# EAGLE design monoblink_wifi (EAGLE 9.0.0)
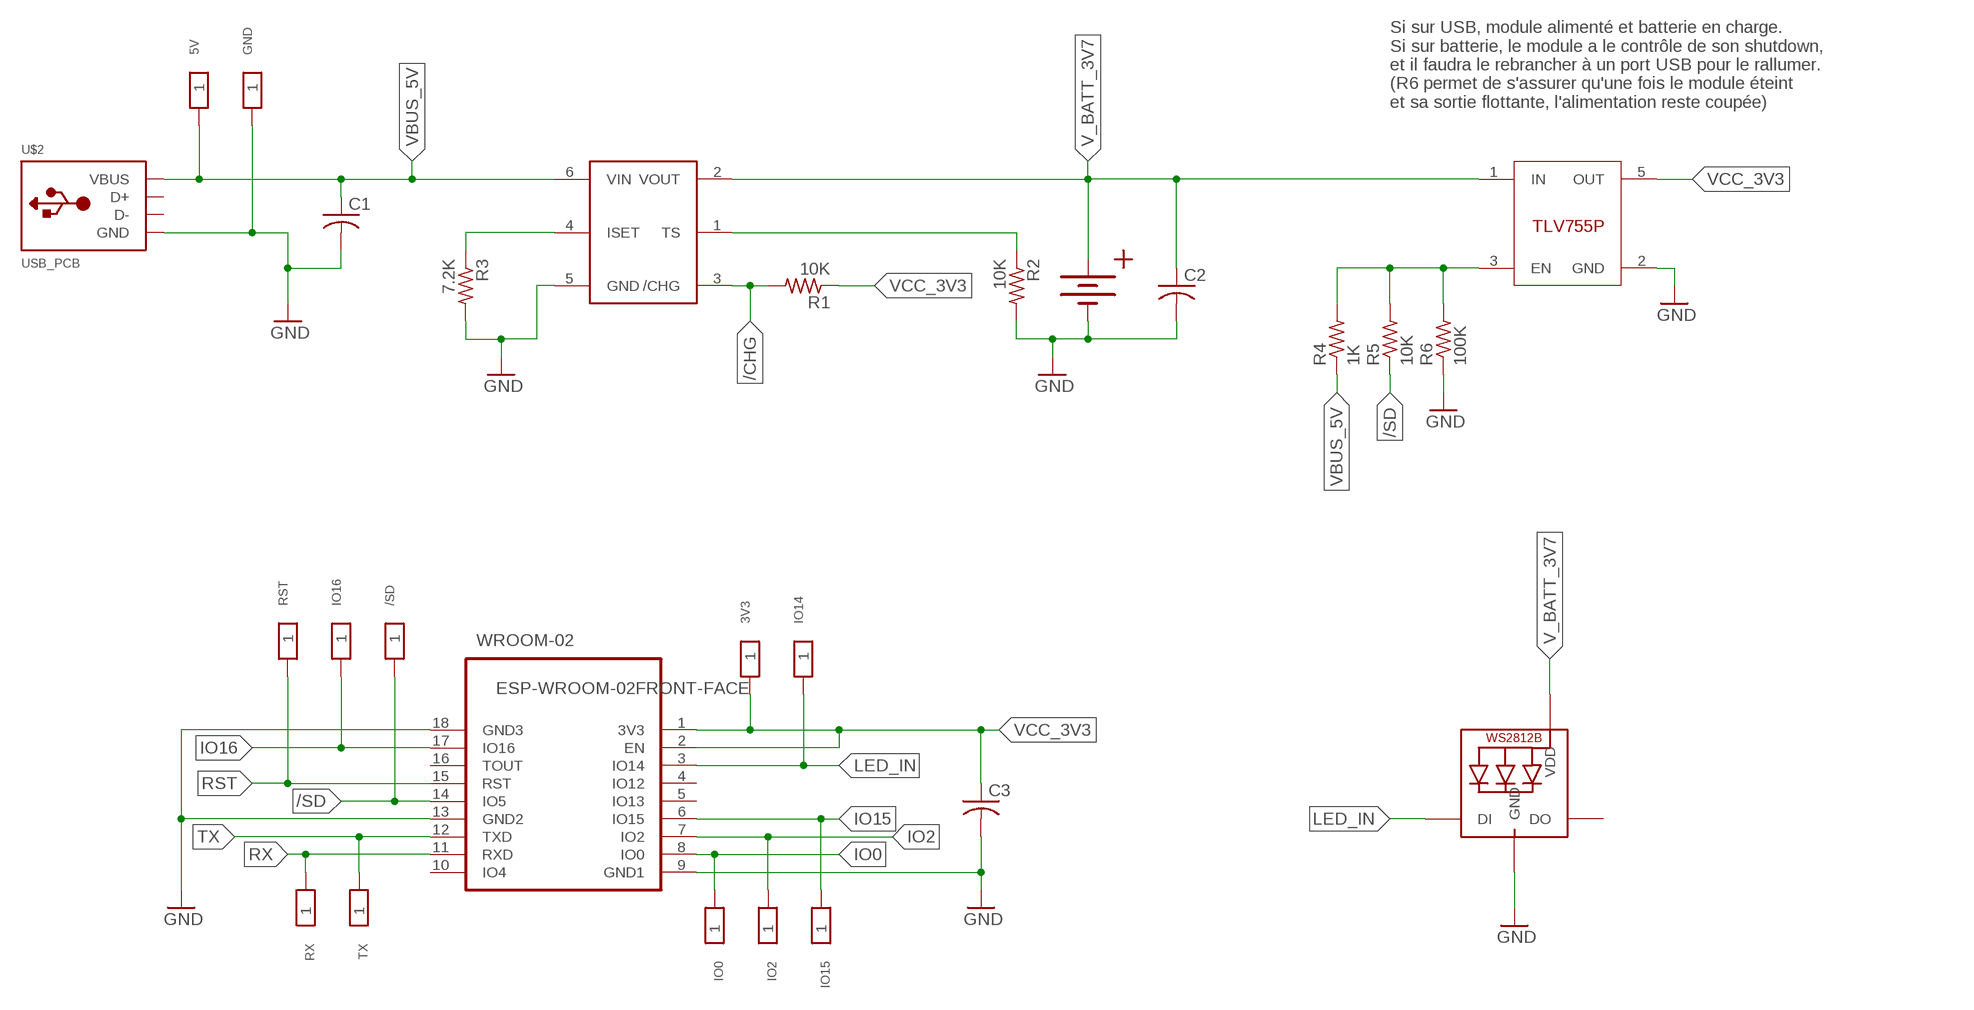
[diagram p0: schematic, sheet 1]

## Parts
3V3  TESTPAD_PROG  [TP1.5MM]
5V  TESTPAD_PROG  [TP1.5MM]
/SD  TESTPAD_PROG  [TP1.5MM]
C1  C-USC0603  [C0603]
C2  C-USC0603  [C0603]
C3  C-USC0603  [C0603]
CHG  BQ21040  [SOT23-6]
GND  TESTPAD_PROG  [TP1.5MM]
IO0  TESTPAD_PROG  [TP1.5MM]
IO2  TESTPAD_PROG  [TP1.5MM]
IO14  TESTPAD_PROG  [TP1.5MM]
IO15  TESTPAD_PROG  [TP1.5MM]
IO16  TESTPAD_PROG  [TP1.5MM]
LDO  TLV755P  [SOT23-5]
LED  WS2812B5050  [WS2812B]
R1  10K  R-US_R0603  [R0603]
R2  10K  R-US_R0603  [R0603]
R3  7.2K  R-US_R0603  [R0603]
R4  1K  R-US_R0603  [R0603]
R5  10K  R-US_R0603  [R0603]
R6  100K  R-US_R0603  [R0603]
RST  TESTPAD_PROG  [TP1.5MM]
RX  TESTPAD_PROG  [TP1.5MM]
TX  TESTPAD_PROG  [TP1.5MM]
U$2  USB_PCB  [USB_PADS]
U$5  BATT  [BATT_CON]
WROOM-02  ESP-WROOM-02FRONT-FACE  [FRONT-FACE]

## Nets
/CHG: CHG.3(/CHG) R1.2
/SD: /SD.1 R5.1 WROOM-02.14(IO5)
EN: LDO.3(EN) R4.2 R5.2 R6.2
GND: C1.2 C2.2 C3.2 CHG.5(GND) GND.1 LDO.2(GND) LED.3-GND(GND) R2.2 R3.2 R6.1 U$2.GND U$5.V-(-) WROOM-02.9(GND1) WROOM-02.13(GND2) WROOM-02.18(GND3)
IO0: IO0.1 WROOM-02.8(IO0)
IO2: IO2.1 WROOM-02.7(IO2)
IO15: IO15.1 WROOM-02.6(IO15)
IO16: IO16.1 WROOM-02.17(IO16)
ISET: CHG.4(ISET) R3.1
LED_IN: IO14.1 LED.4-DIN(DI) WROOM-02.3(IO14)
RST: RST.1 WROOM-02.15(RST)
RX: RX.1 WROOM-02.11(RXD)
TS: CHG.1(TS) R2.1
TX: TX.1 WROOM-02.12(TXD)
V_BATT_3V7: C2.1 CHG.2(VOUT) LDO.1(IN) LED.1-VDD(VDD) U$5.V+(+)
VBUS_5V: 5V.1 C1.1 CHG.6(VIN) R4.1 U$2.V_SUPPLY(VBUS)
VCC_3V3: 3V3.1 C3.1 LDO.5(OUT) R1.1 WROOM-02.1(3V3) WROOM-02.2(EN)
Unconnected: LED.2-DOUT(DO) U$2.D+ U$2.D- WROOM-02.4(IO12) WROOM-02.5(IO13) WROOM-02.10(IO4) WROOM-02.16(TOUT)

## Notes on the sheet
- Si sur USB, module alimenté et batterie en charge.
  Si sur batterie, le module a le contrôle de son shutdown,
  et il faudra le rebrancher à un port USB pour le rallumer.
  (R6 permet de s'assurer qu'une fois le module éteint
  et sa sortie flottante, l'alimentation reste coupée)

## Library data of the parts
3V3 5V /SD GND IO0 IO2 IO14-IO16 RST RX TX = monoblink_wifi:TESTPAD_PROG: TESTPAD
C1-C3 = monoblink_wifi:C-US: CAPACITOR, American symbol; SPICEPREFIX: C
CHG = monoblink_wifi:BQ21040
LDO = monoblink_wifi:TLV755P
LED = monoblink_wifi:WS2812B
R1-R6 = monoblink_wifi:R-US_: RESISTOR, American symbol; SPICEPREFIX: R
U$2 = monoblink_wifi:USB_PCB
U$5 = monoblink_wifi:BATT
WROOM-02 = monoblink_wifi:ESP-WROOM-02: WiFi module - ESP-WROOM-02

## Board
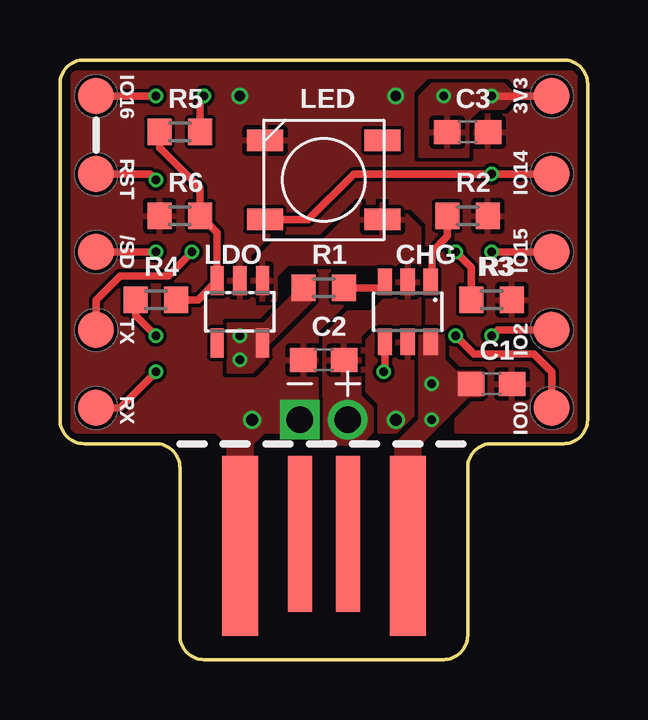
[diagram p1: board, top side]
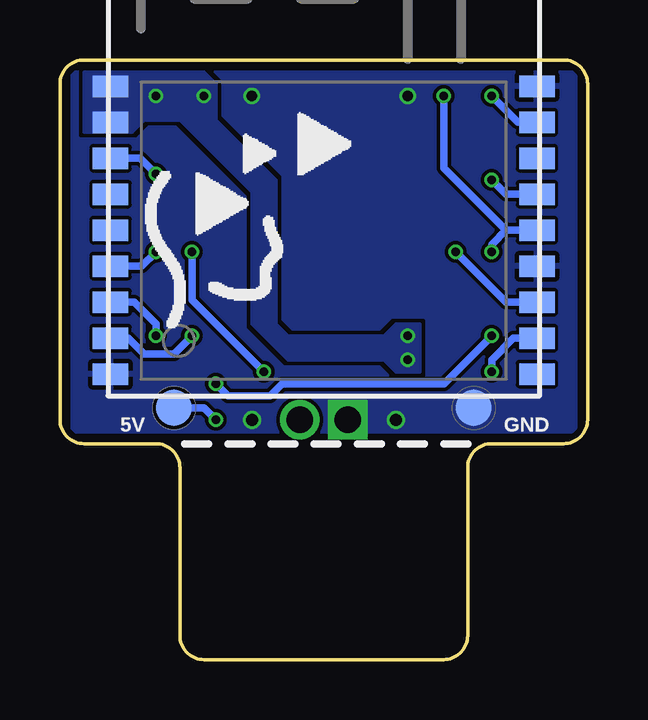
[diagram p2: board, bottom side, seen from below]

Size 22 x 25 mm. Coordinates in mm from the lower left corner, seen from the top.
Outline: 21,9 arc90 22,10 22,24 arc90 21,25 1,25 arc90 0,24 0,10 arc90 1,9 4,9 arc-90 5,8 5,1 arc90 6,0 16,0 arc90 17,1 17,8 arc-90 18,9 21,9
Copper layers (1*16): Top 0.018mm / dielectric 1.55mm / Bottom 0.018mm
Design rules "eC_2Layer_PClass6_BaseCopperO18_eCDefault": minimum track width 0.15mm, minimum drill 0.35mm, track to track 0.15mm, track to pad 0.15mm, pad to pad 0.15mm, via to via 0.15mm, smd to smd 0mil, copper to edge 0.25mm, drill to drill 0.35mm, minimum pad ring 0.175mm, minimum via ring 0.125mm, stop-mask expansion 0mil, vias tented up to drill 0.45mm, thermal gap 0.2mm

### Footprints (pad centres in the part's own frame; a part is rotated, then mirrored left to right if it is on the bottom)
TP1.5MM = smd 1.5 x 1.5: 1 0,0
C0603 = smd 1.1 x 1: 1 -0.85,0; 2 0.85,0
SOT23-6 = smd 0.6 x 1.1: 1 -0.95,-1.25; 2 0,-1.25; 3 0.95,-1.25; 4 0.95,1.25; 5 0,1.25; 6 -0.95,1.25
SOT23-5 = smd 0.55 x 1.2: 1 -0.95,-1.3; 2 0,-1.3; 3 0.95,-1.3; 4 0.95,1.3; 5 -0.95,1.3
WS2812B = smd 1.5 x 0.9: 1-VDD 2.45,-1.65; 2-DOUT 2.45,1.65; 3-GND -2.45,1.65; 4-DIN -2.45,-1.65
R0603 = smd 1 x 1.1: 1 -0.85,0; 2 0.85,0
USB_PADS = smd 1 x 6.5: D+ 1,3.25; D- -1,3.25 | smd 1.5 x 7.5: GND 3.5,3.75; V_SUPPLY -3.5,3.75
BATT_CON = drill 1.1 pad 1.6: V+ 0,0 | drill 1.1 pad 1.6 square: V- 2,0
FRONT-FACE = smd 1.485 x 0.9: 1 -8.893,4.9; 2 -8.893,3.4; 3 -8.893,1.9; 4 -8.893,0.4; 5 -8.893,-1.1; 6 -8.893,-2.6; 7 -8.893,-4.1; 8 -8.893,-5.6; 9 -8.893,-7.1; 10 8.893,-7.1; 11 8.893,-5.6; 12 8.893,-4.1; 13 8.893,-2.6; 14 8.893,-1.1; 15 8.893,0.4; 16 8.893,1.9; 17 8.893,3.4; 18 8.893,4.9

### Placement (x,y rotation side)
3V3  20.5,23.5 0 top
5V  17.25,10.5 0 bottom
/SD  1.5,17 0 top
C1  18,11.5 0 top
C2  11,12.5 180 top
C3  17,22 0 top
CHG  14.5,14.5 180 top
GND  4.75,10.5 0 bottom
IO0  20.5,10.5 0 top
IO2  20.5,13.75 0 top
IO14  20.5,20.25 0 top
IO15  20.5,17 0 top
IO16  1.5,23.5 0 top
LDO  7.5,14.5 180 top
LED  11,20 0 top
R1  11,15.5 0 top
R2  17,18.5 0 top
R3  18,15 0 top
R4  4,15 0 top
R5  5,22 180 top
R6  5,18.5 0 top
RST  1.5,20.25 0 top
RX  1.5,10.5 0 top
TX  1.5,13.75 0 top
U$2  11,8.5 180 top
U$5  12,10 180 top
WROOM-02  11,19 0 bottom

### Tracks (layer width: path | path; a pad name or v marks a point on that pad's centre or on a via)
/CHG
  Top 0.305: R1.2 13.3,15.5 CHG.3
/SD  (via drill 0.35)
  Top 0.305: R5.1 5.85,23.15 v6,23.5 | /SD.1 v4,17
  Bottom 0.305: v6,23.5 6,20.5 3.4,17.9 | 3.4,17.9 WROOM-02.14 | 3.4,17.9 4,17.3 v4,17
EN
  Top 0.305: R4.2 5.75,15 LDO.3 6.55,17.8 R6.2 5.85,19.65 4.15,21.35 R5.2
GND  (via drill 0.45, 0.5 pad 0.7)
  other vias: 8,10 7.5,23.5 14,23.5 14,10
  pour Top (rank 2): 0.5,24.5 21.5,24.5 21.5,9.5 16.5,9.5 16.5,11 5.5,11 5.5,9.5 0.5,9.5
  pour Bottom (rank 2, no thermals): 3.5,24.5 18.5,24.5 18.5,9.5 3.5,9.5
  pour Bottom (rank 2): 3.5,24.5 0.5,24.5 0.5,9.5 3.5,9.5
  pour Bottom (rank 2): 21.5,24.5 18.5,24.5 18.5,9.5 21.5,9.5
  pour Top (rank 2, no thermals): 5.5,9.5 5.5,11 16.5,11 16.5,9.5 8.5,9.5 8,9 8,8.5 7,8.5 7,9 6.5,9.5
IO0  (via drill 0.35)
  Top 0.305: IO0.1 20.5,12 19.75,12.75 17.25,12.75 v16.5,13.5
  Bottom 0.305: 19.79,13.5 WROOM-02.8 19.15,13.4 18.5,12.75 17.25,12.75 v16.5,13.5
IO2  (via drill 0.35)
  Top 0.305: v18,13.5 18.25,13.75 IO2.1
  Bottom 0.305: WROOM-02.7 18.9,14.9 18,14 v18,13.5
IO15  (via drill 0.35)
  Top 0.305: v18,17 IO15.1
  Bottom 0.305: WROOM-02.6 18.6,16.4 v18,17
IO16  (via drill 0.35)
  Top 0.305: v4,23.5 IO16.1
  Bottom 0.305: WROOM-02.17 2.9,22.4 v4,23.5
ISET  (via drill 0.35)
  Top 0.305: 17,15.35 R3.1 17.15,16.35 v16.5,17 | v13.5,12 13.55,12.05 CHG.4
  Bottom 0.305: v13.5,12 16.5,15 v16.5,17
LED_IN  (via drill 0.35)
  Top 0.305: LED.4-DIN 10.35,18.35 12.25,20.25 v18,20.25 IO14.1
  Bottom 0.305: 19.79,21 WROOM-02.3 18.65,20.9 v18,20.25
RST  (via drill 0.35)
  Top 0.305: v4,20 3.75,20.25 RST.1
  Bottom 0.305: v4,20 3.4,19.4 WROOM-02.15
RX  (via drill 0.35)
  Top 0.305: RX.1 2.5,10.5 v4,12
  Bottom 0.305: WROOM-02.11 3.1,13.4 4,12.5 v4,12
TS
  Top 0.305: CHG.1 15.5,15.8 15.5,17 16.15,17.65 R2.1
TX  (via drill 0.35)
  Top 0.305: TX.1 1.5,15 2.5,16 4.5,16 v5.5,17
  Bottom 0.305: WROOM-02.12 3.4,14.9 v5.5,17
V_BATT_3V7
  Top 0.305: LED.1-VDD 13.65,18.35 | 12,12.35 C2.1
  pour Top: 8,16.5 8,15 9,15 9,16 9.5,16.5 14,16.5 14,15 13.5,15 13,14.5 12,14.5 11,13.5 11,9 12.5,9 13,9.5 13,10.5 12.5,11 12.5,13.5 13,14 15,14 15,18 14,19 12.5,19 11,17.5 9,17.5
VBUS_5V  (via drill 0.35)
  Top 0.305: 15.5,13.2 CHG.6 | R4.1 3.15,14.35 v4,13.5
  Bottom 0.305: v4,13.5 6,11.5 12.75,11.5 13.25,11 15,11 v15.5,11.5 | v15.5,10 16,10.5 5V.1
  pour Top (no thermals): 14,1.5 15,1.5 15,9 17,11 17.5,11 17.5,12 16.5,12 16,12.5 16,13.5 15,13.5 15,10 14,9
VCC_3V3  (via drill 0.35)
  Top 0.305: v18,23.5 3V3.1
  other vias: 16,23.5 7.5,12.5 7.5,13.5
  pour Bottom (no thermals): 21,22 21,24.5 16,24.5 15.5,24 15.5,22.5 13,20 13,14 12.5,13.5 8.5,13.5 8,14 7,14 7,12 8,12 8.5,12.5 12.5,12.5 14,14 14,19.5 17,22.5 18.5,22.5 19,22
  pour Top (no thermals): 15,23 18.5,23 19,23.5 18.5,24 15.5,24 15,23.5
  pour Top (no thermals): 7,14 7,12 8,12 8.5,12.5 8.5,13 10.5,15 10.5,16 10,16 10,15.5 8.5,14
  pour Top: 15,23 15,21 17,21 17,22.5 17.5,23

### Text on the board
_tNames: IO16 | R5 | LED | C3 | 3V3 | RST | R6 | R2 | IO14 | /SD | R4 | LDO | R1 | CHG | R3 | IO15 | TX | C2 | C1 | IO2 | RX | IO0
_bNames: GND | 5V